# EAGLE schematic SilentStepStick-TMC2130_v10 (EAGLE 7.5.0)
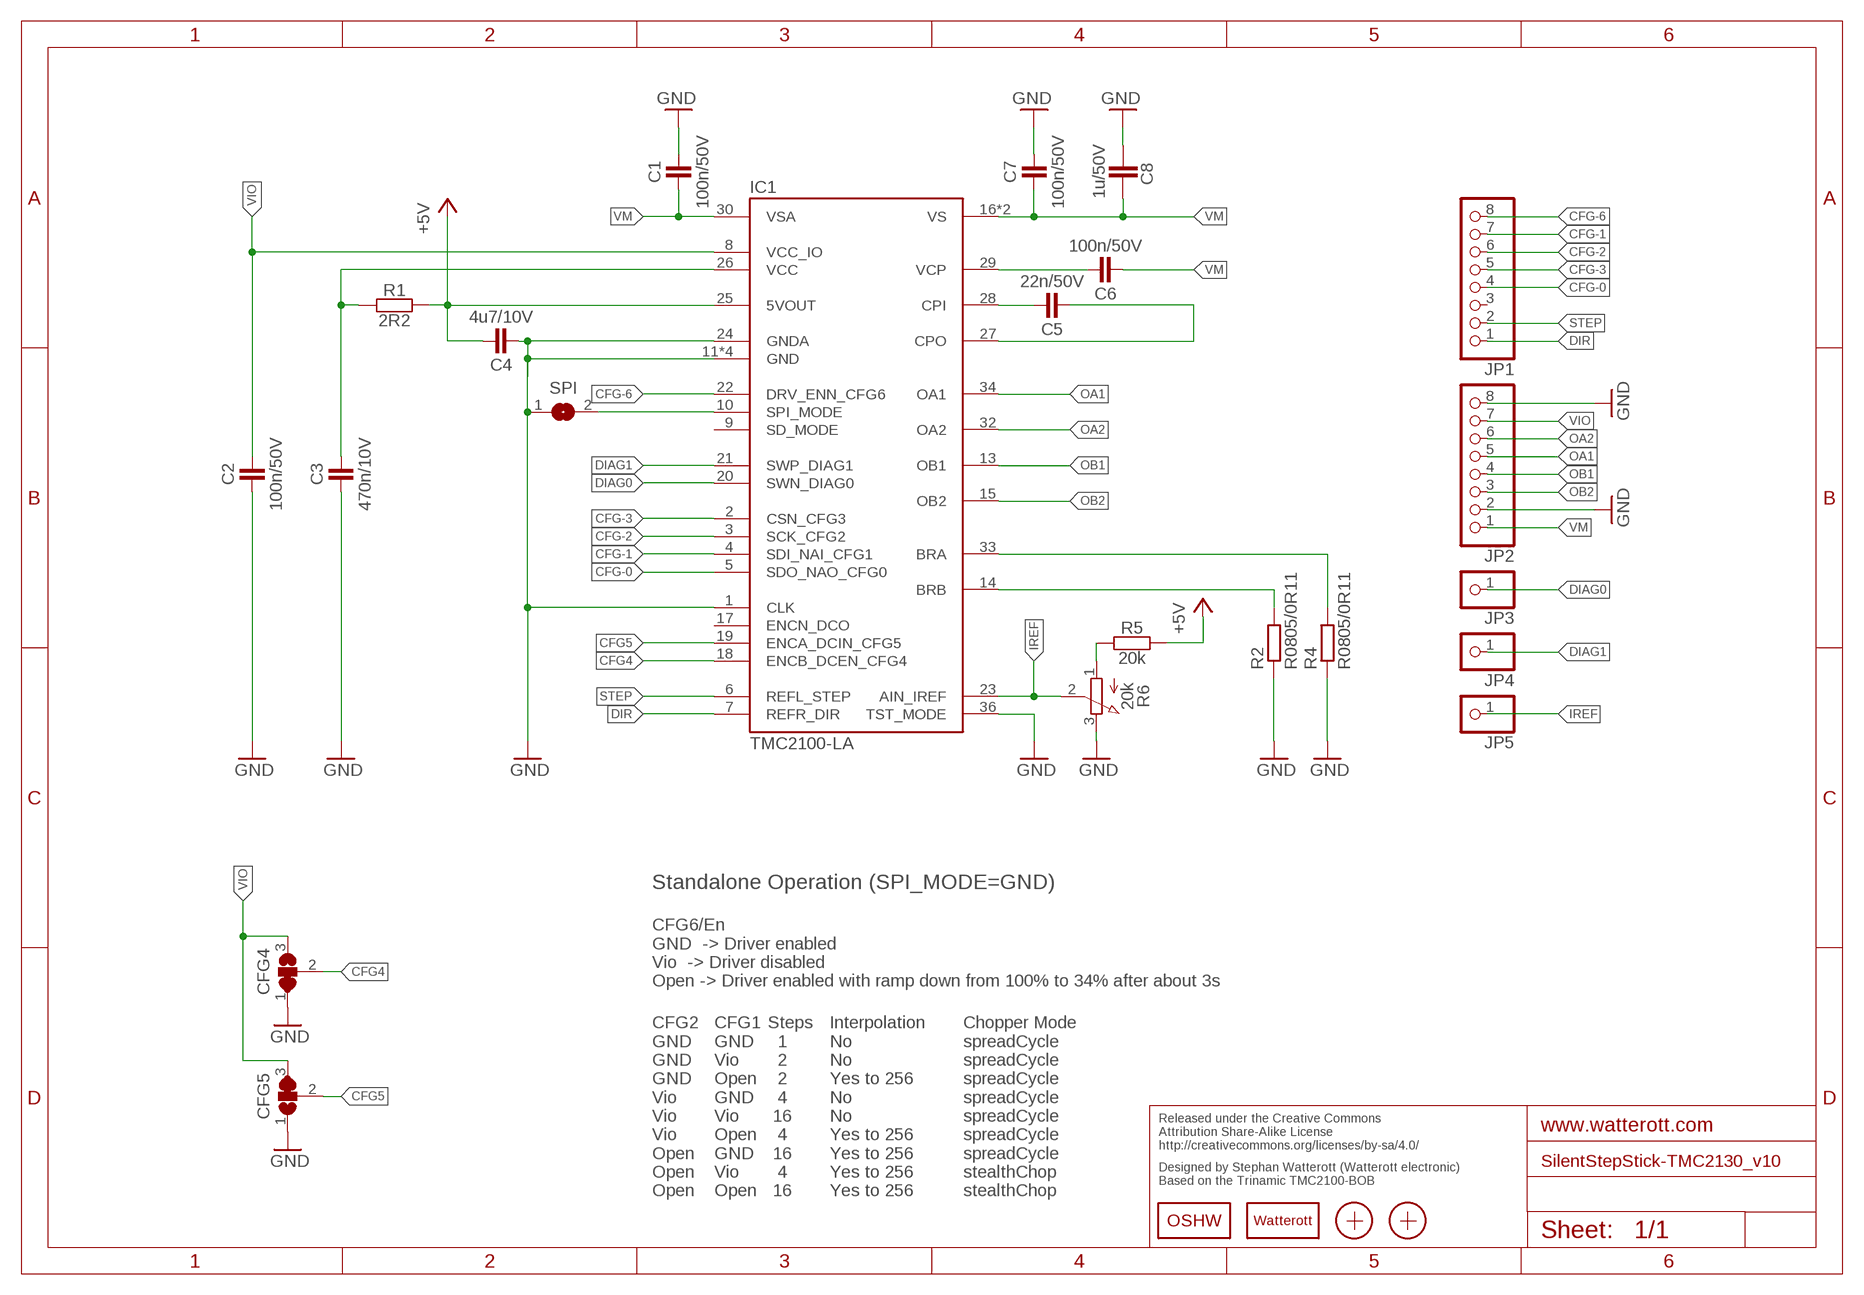
[diagram p0: schematic, sheet 1]

## Parts
C1  100n/50V  CAPACITOR-0402  [C0402]
C2  100n/50V  CAPACITOR-0402  [C0402]
C3  470n/10V  CAPACITOR-0402  [C0402]
C4  4u7/10V  CAPACITOR-0402  [C0402]
C5  22n/50V  CAPACITOR-0402  [C0402]
C6  100n/50V  CAPACITOR-0402  [C0402]
C7  100n/50V  CAPACITOR-0402  [C0402]
C8  1u/50V  C-EUC0603  [C0603]
CFG4  JUMPER3-0201  [JUMPER3-0201]
CFG5  JUMPER3-0201  [JUMPER3-0201]
IC1  TMC2100-LA  [QFN36-PAD]
JP1  PINHD-1X08_2.54-S  [1X08-S]
JP2  PINHD-1X08_2.54-S  [1X08-S]
JP3  PINHD-1X1  [1X01]
JP4  PINHD-1X1  [1X01]
JP5  PINHD-1X1  [1X01]
LOGO1  OSHW_LOGOX0070  [OSHW_6X70]
LOGO2  LOGO-S_PLACE_M  [SPARK_TPLACE_M]
R1  2R2  RESISTOR-0402  [C0402]
R2  R0805/0R11  R-EU_M0805  [M0805]
R4  R0805/0R11  R-EU_M0805  [M0805]
R5  20k  RESISTOR-0402  [C0402]
R6  20k  POTEVM3R  [POT_EVM3R]
SPI  JUMPER2-0402-NC  [JUMPER2-0402_NC]
X1  PASSER-07  [PASSER_07MM]
X2  PASSER-07  [PASSER_07MM]

## Nets
+5V: C4.2 IC1.25(5VOUT) R1.2 R5.2
BRA: IC1.33(BRA) R4.2
BRB: IC1.14(BRB) R2.2
CFG4: CFG4.2 IC1.18(ENCB_DCEN_CFG4)
CFG5: CFG5.2 IC1.19(ENCA_DCIN_CFG5)
CFG-0: IC1.5(SDO_NAO_CFG0) JP1.4
CFG-1: IC1.4(SDI_NAI_CFG1) JP1.7
CFG-2: IC1.3(SCK_CFG2) JP1.6
CFG-3: IC1.2(CSN_CFG3) JP1.5
CFG-6: IC1.22(DRV_ENN_CFG6) JP1.8
CPI: C5.2 IC1.28(CPI)
CPO: C5.1 IC1.27(CPO)
DIAG0: IC1.20(SWN_DIAG0) JP3.1
DIAG1: IC1.21(SWP_DIAG1) JP4.1
DIR: IC1.7(REFR_DIR) JP1.1
GND: C1.2 C2.1 C3.1 C4.1 C7.2 C8.2 CFG4.1 CFG5.1 IC1.1(CLK) IC1.11(GND) IC1.12(GND) IC1.24(GNDA) IC1.35(GND) IC1.36(TST_MODE) IC1.TP(GND) JP2.2 JP2.8 R2.1 R4.1 R6.3(E) SPI.1
IREF: IC1.23(AIN_IREF) JP5.1 R6.2(S)
N$1: IC1.10(SPI_MODE) SPI.2
OA1: IC1.34(OA1) JP2.5
OA2: IC1.32(OA2) JP2.6
OB1: IC1.13(OB1) JP2.4
OB2: IC1.15(OB2) JP2.3
STEP: IC1.6(REFL_STEP) JP1.2
VCC: C3.2 IC1.26(VCC) R1.1
VCP: C6.2 IC1.29(VCP)
VIO: C2.2 CFG4.3 CFG5.3 IC1.8(VCC_IO) JP2.7
VM: C1.1 C6.1 C7.1 C8.1 IC1.16(VS) IC1.30(VSA) IC1.31(VS) JP2.1
VREF1: R5.1 R6.1(A)
Unconnected: IC1.9(SD_MODE) IC1.17(ENCN_DCO) JP1.3

## Notes on the sheet
- Standalone Operation (SPI_MODE=GND)
- CFG6/En
  GND  -> Driver enabled
  Vio  -> Driver disabled
  Open -> Driver enabled with ramp down from 100% to 34% after about 3s
- CFG2
  GND
  GND
  GND
  Vio
  Vio
  Vio
  Open
  Open
  Open
- CFG1
  GND
  Vio
  Open
  GND
  Vio
  Open
  GND
  Vio
  Open
- Steps
    1
    2
    2
    4
   16
    4
   16
    4
   16
- Interpolation
  No
  No
  Yes to 256
  No
  No
  Yes to 256
  Yes to 256
  Yes to 256
  Yes to 256
- Chopper Mode
  spreadCycle
  spreadCycle
  spreadCycle
  spreadCycle
  spreadCycle
  spreadCycle
  spreadCycle
  stealthChop
  stealthChop
- Released under the Creative Commons
  Attribution Share-Alike License
  http://creativecommons.org/licenses/by-sa/4.0/
- Designed by Stephan Watterott (Watterott electronic) 
  Based on the Trinamic TMC2100-BOB

## Library data of the parts
C1-C7 = we-rcl:CAPACITOR: Capacitors ...2.2uF @ 6.3V -> 0402 ...4.7uF @ 6.3V -> 0603 ...10uF @ 16V -> 0805 ...22uF @ 25V -> 1206
C8 = rcl:C-EU: CAPACITOR, European symbol
CFG4 CFG5 = we-rcl:JUMPER3: 3 Pin Jumpers
IC1 = we-chip:TMC2100: Trinamic TMC2100 Stepper Motor Driver (5V...46V, 1.2A RMS, 256 microsteps)
JP1 JP2 = pinhead-2:PINHD-1X08: PIN HEADER
JP3-JP5 = pinhead:PINHD-1X1: PIN HEADER
LOGO1 = we-symbol:OSHW_LOGO: Open-Source-Hardware Logo
LOGO2 = we-symbol:LOGO: Watterott electronic Logo
R1 R5 = we-rcl:RESISTOR: Resistors all kinds in 0402 and 0603
R2 R4 = rcl:R-EU_: RESISTOR, European symbol
R6 = we-rcl:POT: Potentiometer
SPI = we-rcl:JUMPER2: 2 Pin Jumpers
X1 X2 = we-symbol:PASSER: Fiducial Markers